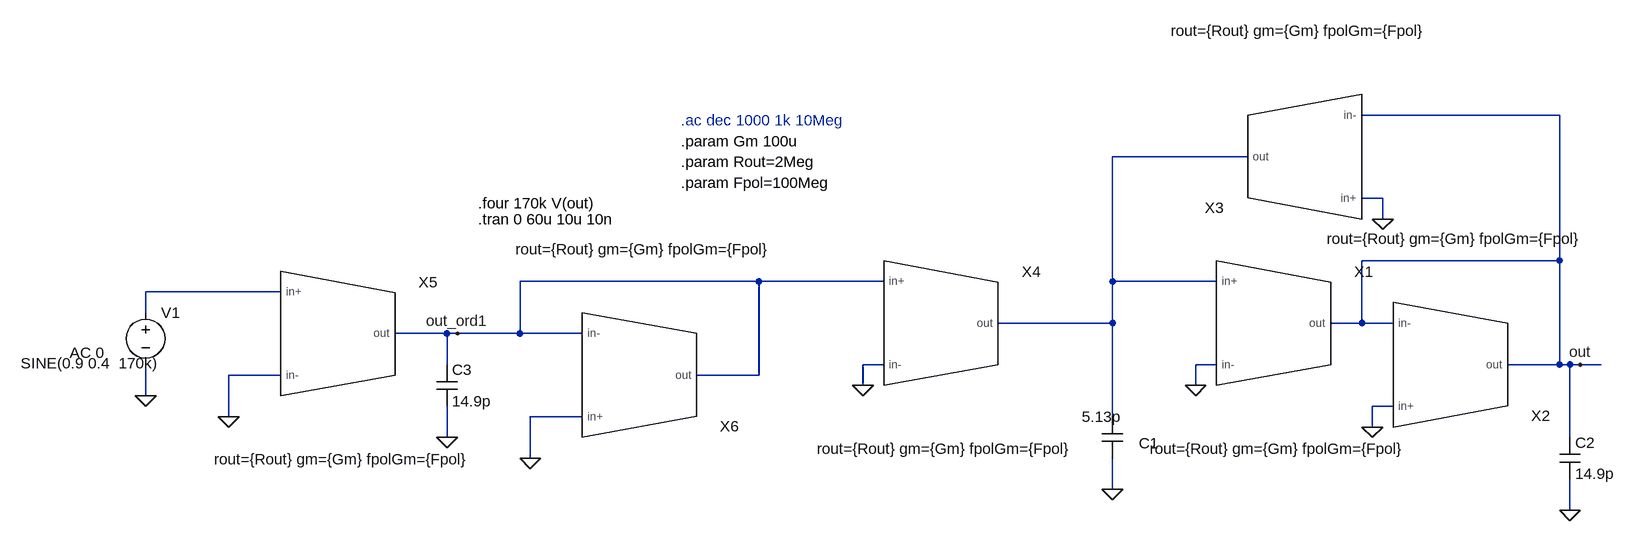
[diagram p0: schematic THDVerificare.asc]
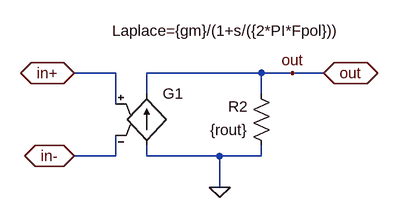
[diagram p1: sub-circuit gm_model.asc]
THDVerificare.asc, the LTspice schematic file:
Version 4.1
SHEET 1 1120 680
WIRE 1040 -256 736 -256
WIRE 560 -192 352 -192
WIRE 768 -128 736 -128
WIRE 768 -96 768 -128
WIRE 1040 -32 1040 -256
WIRE 1040 -32 736 -32
WIRE -192 0 -560 0
WIRE 0 0 -192 0
WIRE 352 0 352 -192
WIRE 512 0 352 0
WIRE -928 16 -1136 16
WIRE -1136 48 -1136 16
WIRE 352 64 352 0
WIRE 352 64 176 64
WIRE 736 64 736 -32
WIRE 736 64 688 64
WIRE 784 64 736 64
WIRE -672 80 -752 80
WIRE -656 80 -672 80
WIRE -560 80 -560 0
WIRE -560 80 -656 80
WIRE -464 80 -560 80
WIRE -672 128 -672 80
WIRE 0 128 -32 128
WIRE 512 128 480 128
WIRE 1040 128 1040 -32
WIRE 1040 128 960 128
WIRE 1056 128 1040 128
WIRE 1072 128 1056 128
WIRE 1104 128 1072 128
WIRE -928 144 -1008 144
WIRE -192 144 -192 0
WIRE -192 144 -288 144
WIRE -32 160 -32 128
WIRE 480 160 480 128
WIRE -1136 176 -1136 128
WIRE 784 192 752 192
WIRE -1008 208 -1008 144
WIRE -464 208 -544 208
WIRE 352 208 352 64
WIRE 752 224 752 192
WIRE -672 240 -672 192
WIRE 1056 240 1056 128
WIRE -544 272 -544 208
WIRE 352 320 352 272
WIRE 1056 352 1056 304
FLAG 1072 128 out
FLAG 1056 352 0
FLAG 352 320 0
FLAG 480 160 0
FLAG 752 224 0
FLAG 768 -96 0
FLAG -32 160 0
FLAG -1136 176 0
FLAG -656 80 out_ord1
FLAG -672 240 0
FLAG -1008 208 0
FLAG -544 272 0
DATAFLAG 896 -32 ""
SYMBOL cap 336 208 R0
WINDOW 3 -31 0 Left 2
WINDOW 0 57 41 Left 2
SYMATTR Value 5.13p
SYMATTR InstName C1
SYMBOL cap 1040 240 R0
SYMATTR InstName C2
SYMATTR Value 14.9p
SYMBOL Gm_model 736 48 R0
WINDOW 39 -128 225 Bottom 2
SYMATTR SpiceLine rout={Rout} gm={Gm} fpolGm={Fpol}
SYMATTR InstName X1
SYMBOL Gm_model 1008 144 M180
WINDOW 39 -128 225 Bottom 2
SYMATTR SpiceLine rout={Rout} gm={Gm} fpolGm={Fpol}
SYMATTR InstName X2
SYMBOL Gm_model 512 -176 R180
WINDOW 39 -128 225 Bottom 2
SYMATTR SpiceLine rout={Rout} gm={Gm} fpolGm={Fpol}
SYMATTR InstName X3
SYMBOL Gm_model 224 48 R0
WINDOW 39 -128 225 Bottom 2
SYMATTR SpiceLine rout={Rout} gm={Gm} fpolGm={Fpol}
SYMATTR InstName X4
SYMBOL voltage -1136 32 R0
WINDOW 123 -117 78 Left 2
WINDOW 39 0 0 Left 2
WINDOW 3 -192 94 Left 2
SYMATTR Value2 AC 0
SYMATTR InstName V1
SYMATTR Value SINE(0.9 0.4  170k)
SYMBOL cap -688 128 R0
SYMATTR InstName C3
SYMATTR Value 14.9p
SYMBOL Gm_model -704 64 R0
WINDOW 39 -128 225 Bottom 2
SYMATTR SpiceLine rout={Rout} gm={Gm} fpolGm={Fpol}
SYMATTR InstName X5
SYMBOL Gm_model -240 160 M180
WINDOW 39 -128 225 Bottom 2
SYMATTR SpiceLine rout={Rout} gm={Gm} fpolGm={Fpol}
SYMATTR InstName X6
TEXT -312 -248 Left 2 ;.ac dec 1000 1k 10Meg
TEXT -312 -216 Left 2 !.param Gm 100u
TEXT -312 -184 Left 2 !.param Rout=2Meg
TEXT -312 -152 Left 2 !.param Fpol=100Meg
TEXT -624 -96 Left 2 !.tran 0 60u 10u 10n
TEXT -624 -120 Left 2 !.four 170k V(out)

gm_model.asc, the sub-circuit schematic file:
Version 4
SHEET 1 2564 1736
WIRE 1248 208 1184 208
WIRE 1472 208 1296 208
WIRE 1520 208 1472 208
WIRE 1568 208 1520 208
WIRE 1296 240 1296 208
WIRE 1472 240 1472 208
WIRE 1248 256 1248 208
WIRE 1248 336 1248 304
WIRE 1248 336 1184 336
WIRE 1296 336 1296 320
WIRE 1408 336 1296 336
WIRE 1472 336 1472 320
WIRE 1472 336 1408 336
WIRE 1408 384 1408 336
FLAG 1520 208 out
FLAG 1568 208 out
IOPIN 1568 208 BiDir
FLAG 1184 208 in+
IOPIN 1184 208 BiDir
FLAG 1184 336 in-
IOPIN 1184 336 BiDir
FLAG 1408 384 0
SYMBOL g 1296 224 R0
WINDOW 3 -53 -81 Left 2
SYMATTR Value Laplace={gm}/(1+s/({2*PI*Fpol}))
SYMATTR InstName G1
SYMBOL res 1488 336 R180
WINDOW 0 36 76 Left 2
WINDOW 3 36 40 Left 2
SYMATTR InstName R2
SYMATTR Value {rout}

The netlist it stands for:
* THDVerificare.asc
C1 N001 0 5.13p
C2 out 0 14.9p
X§X1 N001 0 out gm_model params: rout={Rout} gm={Gm} fpolGm={Fpol}
X§X2 0 out out gm_model params: rout={Rout} gm={Gm} fpolGm={Fpol}
X§X3 0 out N001 gm_model params: rout={Rout} gm={Gm} fpolGm={Fpol}
X§X4 out_ord1 0 N001 gm_model params: rout={Rout} gm={Gm} fpolGm={Fpol}
V1 N002 0 SINE(0.9 0.4  170k) AC 0
C3 out_ord1 0 14.9p
X§X5 N002 0 out_ord1 gm_model params: rout={Rout} gm={Gm} fpolGm={Fpol}
X§X6 0 out_ord1 out_ord1 gm_model params: rout={Rout} gm={Gm} fpolGm={Fpol}

* block symbol definitions
.subckt gm_model in+ in- out
G1 0 out in+ in- Laplace={gm}/(1+s/({2*PI*Fpol}))
R2 0 out {rout}
.ends gm_model

* .ac dec 1000 1k 10Meg
.param Gm 100u
.param Rout=2Meg
.param Fpol=100Meg
.tran 0 60u 10u 10n
.four 170k V(out)
.backanno
.end